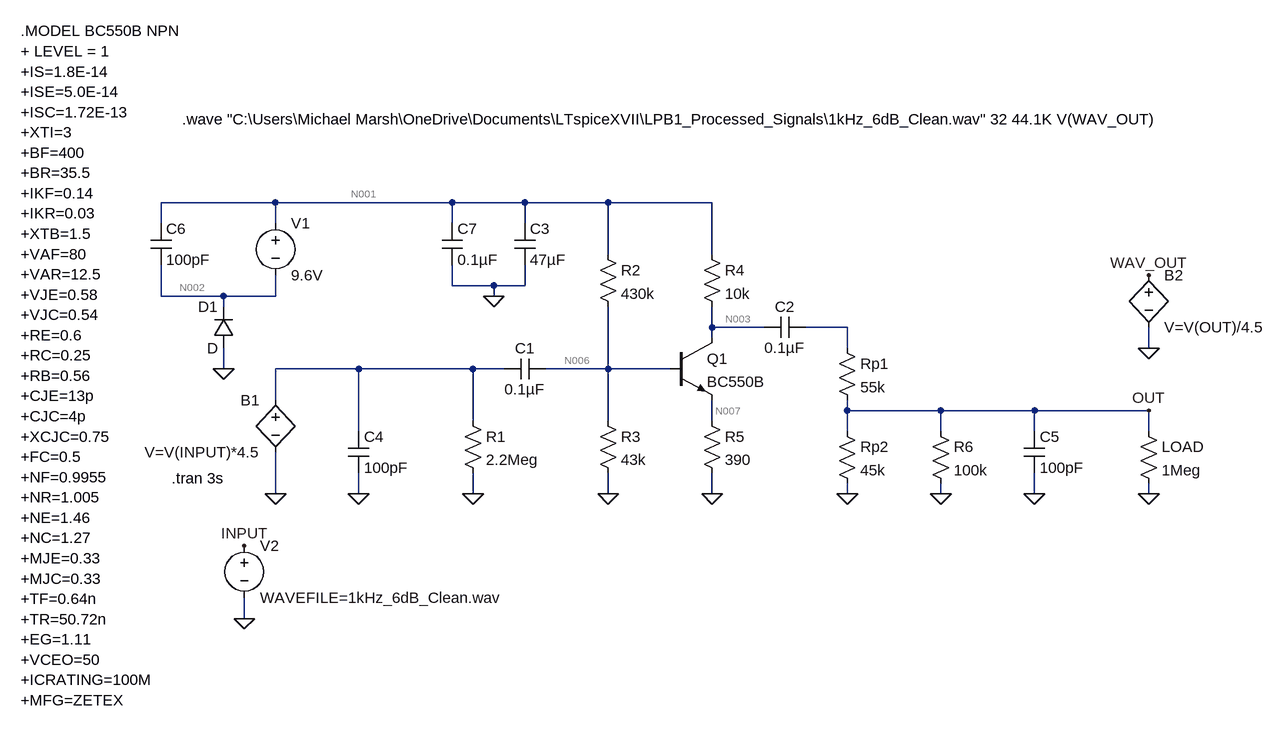
[diagram p0: schematic Reverse_Engineered_LPB1_Final.asc]
Reverse_Engineered_LPB1_Final.asc, the LTspice schematic file:
Version 4
SHEET 1 1524 680
WIRE -176 -208 -352 -208
WIRE 96 -208 -176 -208
WIRE 208 -208 96 -208
WIRE 336 -208 208 -208
WIRE 496 -208 336 -208
WIRE -352 -176 -352 -208
WIRE -176 -176 -176 -208
WIRE 96 -176 96 -208
WIRE 208 -176 208 -208
WIRE 336 -128 336 -208
WIRE 496 -128 496 -208
WIRE 96 -80 96 -112
WIRE 160 -80 96 -80
WIRE 208 -80 208 -112
WIRE 208 -80 160 -80
WIRE -352 -64 -352 -112
WIRE -256 -64 -352 -64
WIRE -176 -64 -176 -96
WIRE -176 -64 -256 -64
WIRE 160 -64 160 -80
WIRE -256 -48 -256 -64
WIRE 496 -16 496 -48
WIRE 576 -16 496 -16
WIRE 704 -16 640 -16
WIRE 496 0 496 -16
WIRE 704 16 704 -16
WIRE 1168 16 1168 -16
WIRE -256 48 -256 16
WIRE -48 48 -176 48
WIRE 128 48 -48 48
WIRE 176 48 128 48
WIRE 336 48 336 -48
WIRE 336 48 240 48
WIRE 432 48 336 48
WIRE -176 96 -176 48
WIRE 704 112 704 96
WIRE 848 112 704 112
WIRE 992 112 848 112
WIRE 1168 112 992 112
WIRE 128 128 128 48
WIRE 336 128 336 48
WIRE 496 128 496 96
WIRE -48 144 -48 48
WIRE 704 144 704 112
WIRE 848 144 848 112
WIRE 992 144 992 112
WIRE 1168 144 1168 112
WIRE -176 240 -176 176
WIRE -48 240 -48 208
WIRE 128 240 128 208
WIRE 336 240 336 208
WIRE 496 240 496 208
WIRE 704 240 704 224
WIRE 848 240 848 224
WIRE 992 240 992 208
WIRE 1168 240 1168 224
WIRE -224 432 -224 400
FLAG 160 -64 0
FLAG 128 240 0
FLAG -48 240 0
FLAG 336 240 0
FLAG 496 240 0
FLAG 704 240 0
FLAG 848 240 0
FLAG 992 240 0
FLAG -256 48 0
FLAG 1168 112 OUT
FLAG 1168 240 0
FLAG -224 432 0
FLAG 1168 16 0
FLAG -176 240 0
FLAG -224 320 INPUT
FLAG 1168 -96 WAV_OUT
SYMBOL res 320 -144 R0
SYMATTR InstName R2
SYMATTR Value 430k
SYMBOL res 320 112 R0
SYMATTR InstName R3
SYMATTR Value 43k
SYMBOL res 480 -144 R0
SYMATTR InstName R4
SYMATTR Value 10k
SYMBOL res 480 112 R0
SYMATTR InstName R5
SYMATTR Value 390
SYMBOL res 832 128 R0
SYMATTR InstName R6
SYMATTR Value 100k
SYMBOL cap 240 32 R90
WINDOW 0 0 32 VBottom 2
WINDOW 3 32 32 VTop 2
SYMATTR InstName C1
SYMATTR Value 0.1µF
SYMBOL cap 640 -32 R90
WINDOW 0 0 32 VBottom 2
WINDOW 3 32 32 VTop 2
SYMATTR InstName C2
SYMATTR Value 0.1µF
SYMBOL cap 192 -176 R0
SYMATTR InstName C3
SYMATTR Value 47µF
SYMBOL cap -64 144 R0
SYMATTR InstName C4
SYMATTR Value 100pF
SYMBOL cap 976 144 R0
SYMATTR InstName C5
SYMATTR Value 100pF
SYMBOL cap -368 -176 R0
SYMATTR InstName C6
SYMATTR Value 100pF
SYMBOL cap 80 -176 R0
SYMATTR InstName C7
SYMATTR Value 0.1µF
SYMBOL npn 432 0 R0
SYMATTR InstName Q1
SYMATTR Value BC550B
SYMBOL res 688 0 R0
SYMATTR InstName Rp1
SYMATTR Value 55k
SYMBOL res 688 128 R0
SYMATTR InstName Rp2
SYMATTR Value 45k
SYMBOL res 112 112 R0
SYMATTR InstName R1
SYMATTR Value 2.2Meg
SYMBOL voltage -176 -192 R0
SYMATTR InstName V1
SYMATTR Value 9.6V
SYMBOL diode -240 16 R180
WINDOW 0 24 64 Left 2
WINDOW 3 24 0 Left 2
SYMATTR InstName D1
SYMBOL voltage -224 304 R0
SYMATTR InstName V2
SYMATTR Value WAVEFILE=1kHz_6dB_Clean.wav
SYMBOL bv -176 80 M0
SYMATTR InstName B1
SYMATTR Value V=V(INPUT)*4.5
SYMBOL bv 1168 -112 R0
SYMATTR InstName B2
SYMATTR Value V=V(OUT)/4.5
SYMBOL res 1152 128 R0
SYMATTR InstName LOAD
SYMATTR Value 1Meg
TEXT -568 -472 Left 2 !.MODEL BC550B NPN\n+ LEVEL = 1\n+IS=1.8E-14 \n+ISE=5.0E-14 \n+ISC=1.72E-13 \n+XTI=3 \n+BF=400 \n+BR=35.5 \n+IKF=0.14 \n+IKR=0.03 \n+XTB=1.5 \n+VAF=80 \n+VAR=12.5 \n+VJE=0.58 \n+VJC=0.54 \n+RE=0.6 \n+RC=0.25 \n+RB=0.56 \n+CJE=13p \n+CJC=4p \n+XCJC=0.75 \n+FC=0.5 \n+NF=0.9955 \n+NR=1.005 \n+NE=1.46 \n+NC=1.27 \n+MJE=0.33 \n+MJC=0.33 \n+TF=0.64n \n+TR=50.72n \n+EG=1.11 \n+VCEO=50 \n+ICRATING=100M \n+MFG=ZETEX
TEXT -336 216 Left 2 !.tran 3s
TEXT -320 -336 Left 2 !.wave "C:\\Users\\Michael Marsh\\OneDrive\\Documents\\LTspiceXVII\\LPB1_Processed_Signals\\1kHz_6dB_Clean.wav" 32 44.1K V(WAV_OUT)

The netlist it stands for:
* Reverse_Engineered_LPB1_Final.asc
R2 N001 N006 430k
R3 N006 0 43k
R4 N001 N003 10k
R5 N007 0 390
R6 OUT 0 100k
C1 N006 N005 0.1µF
C2 N004 N003 0.1µF
C3 N001 0 47µF
C4 N005 0 100pF
C5 OUT 0 100pF
C6 N001 N002 100pF
C7 N001 0 0.1µF
Q1 N003 N006 N007 0 BC550B
Rp1 N004 OUT 55k
Rp2 OUT 0 45k
R1 N005 0 2.2Meg
V1 N001 N002 9.6V
D1 0 N002 D
V2 INPUT 0 WAVEFILE=1kHz_6dB_Clean.wav
B1 N005 0 V=V(INPUT)*4.5
B2 WAV_OUT 0 V=V(OUT)/4.5
R§LOAD OUT 0 1Meg
.model D D
.lib standard.dio
.model NPN NPN
.model PNP PNP
.lib standard.bjt
.MODEL BC550B NPN
+ LEVEL = 1
+IS=1.8E-14
+ISE=5.0E-14
+ISC=1.72E-13
+XTI=3
+BF=400
+BR=35.5
+IKF=0.14
+IKR=0.03
+XTB=1.5
+VAF=80
+VAR=12.5
+VJE=0.58
+VJC=0.54
+RE=0.6
+RC=0.25
+RB=0.56
+CJE=13p
+CJC=4p
+XCJC=0.75
+FC=0.5
+NF=0.9955
+NR=1.005
+NE=1.46
+NC=1.27
+MJE=0.33
+MJC=0.33
+TF=0.64n
+TR=50.72n
+EG=1.11
+VCEO=50
+ICRATING=100M
+MFG=ZETEX
.tran 3s
.wave "C:\Users\Michael Marsh\OneDrive\Documents\LTspiceXVII\LPB1_Processed_Signals\1kHz_6dB_Clean.wav" 32 44.1K V(WAV_OUT)
.backanno
.end

* Results of the author's LTspice run, read from the files saved beside the schematic
* Operating Point, zero values left out:
*   V(n001) = 8.969 V
*   V(n006) = 757.9 mV
*   V(n003) = 5.236 V
*   V(n007) = 146.2 mV
*   V(n002) = -630.9 mV
*   Ic(Q1) = 373.3 µA
*   Ib(Q1) = 1.469 µA
*   Ie(Q1) = -374.8 µA
*   I(D1) = 392.4 µA
*   I(R5) = 374.8 µA
*   I(R4) = 373.3 µA
*   I(R3) = 17.63 µA
*   I(R2) = 19.1 µA
*   I(V1) = -392.4 µA